# Altium schematic sheet RelayModule_LED.SchDoc
size 420 x 297 mm; DocumentNumber: VSL.23-RELAYMODULE Э3; SheetNumber: 4; Format: A3
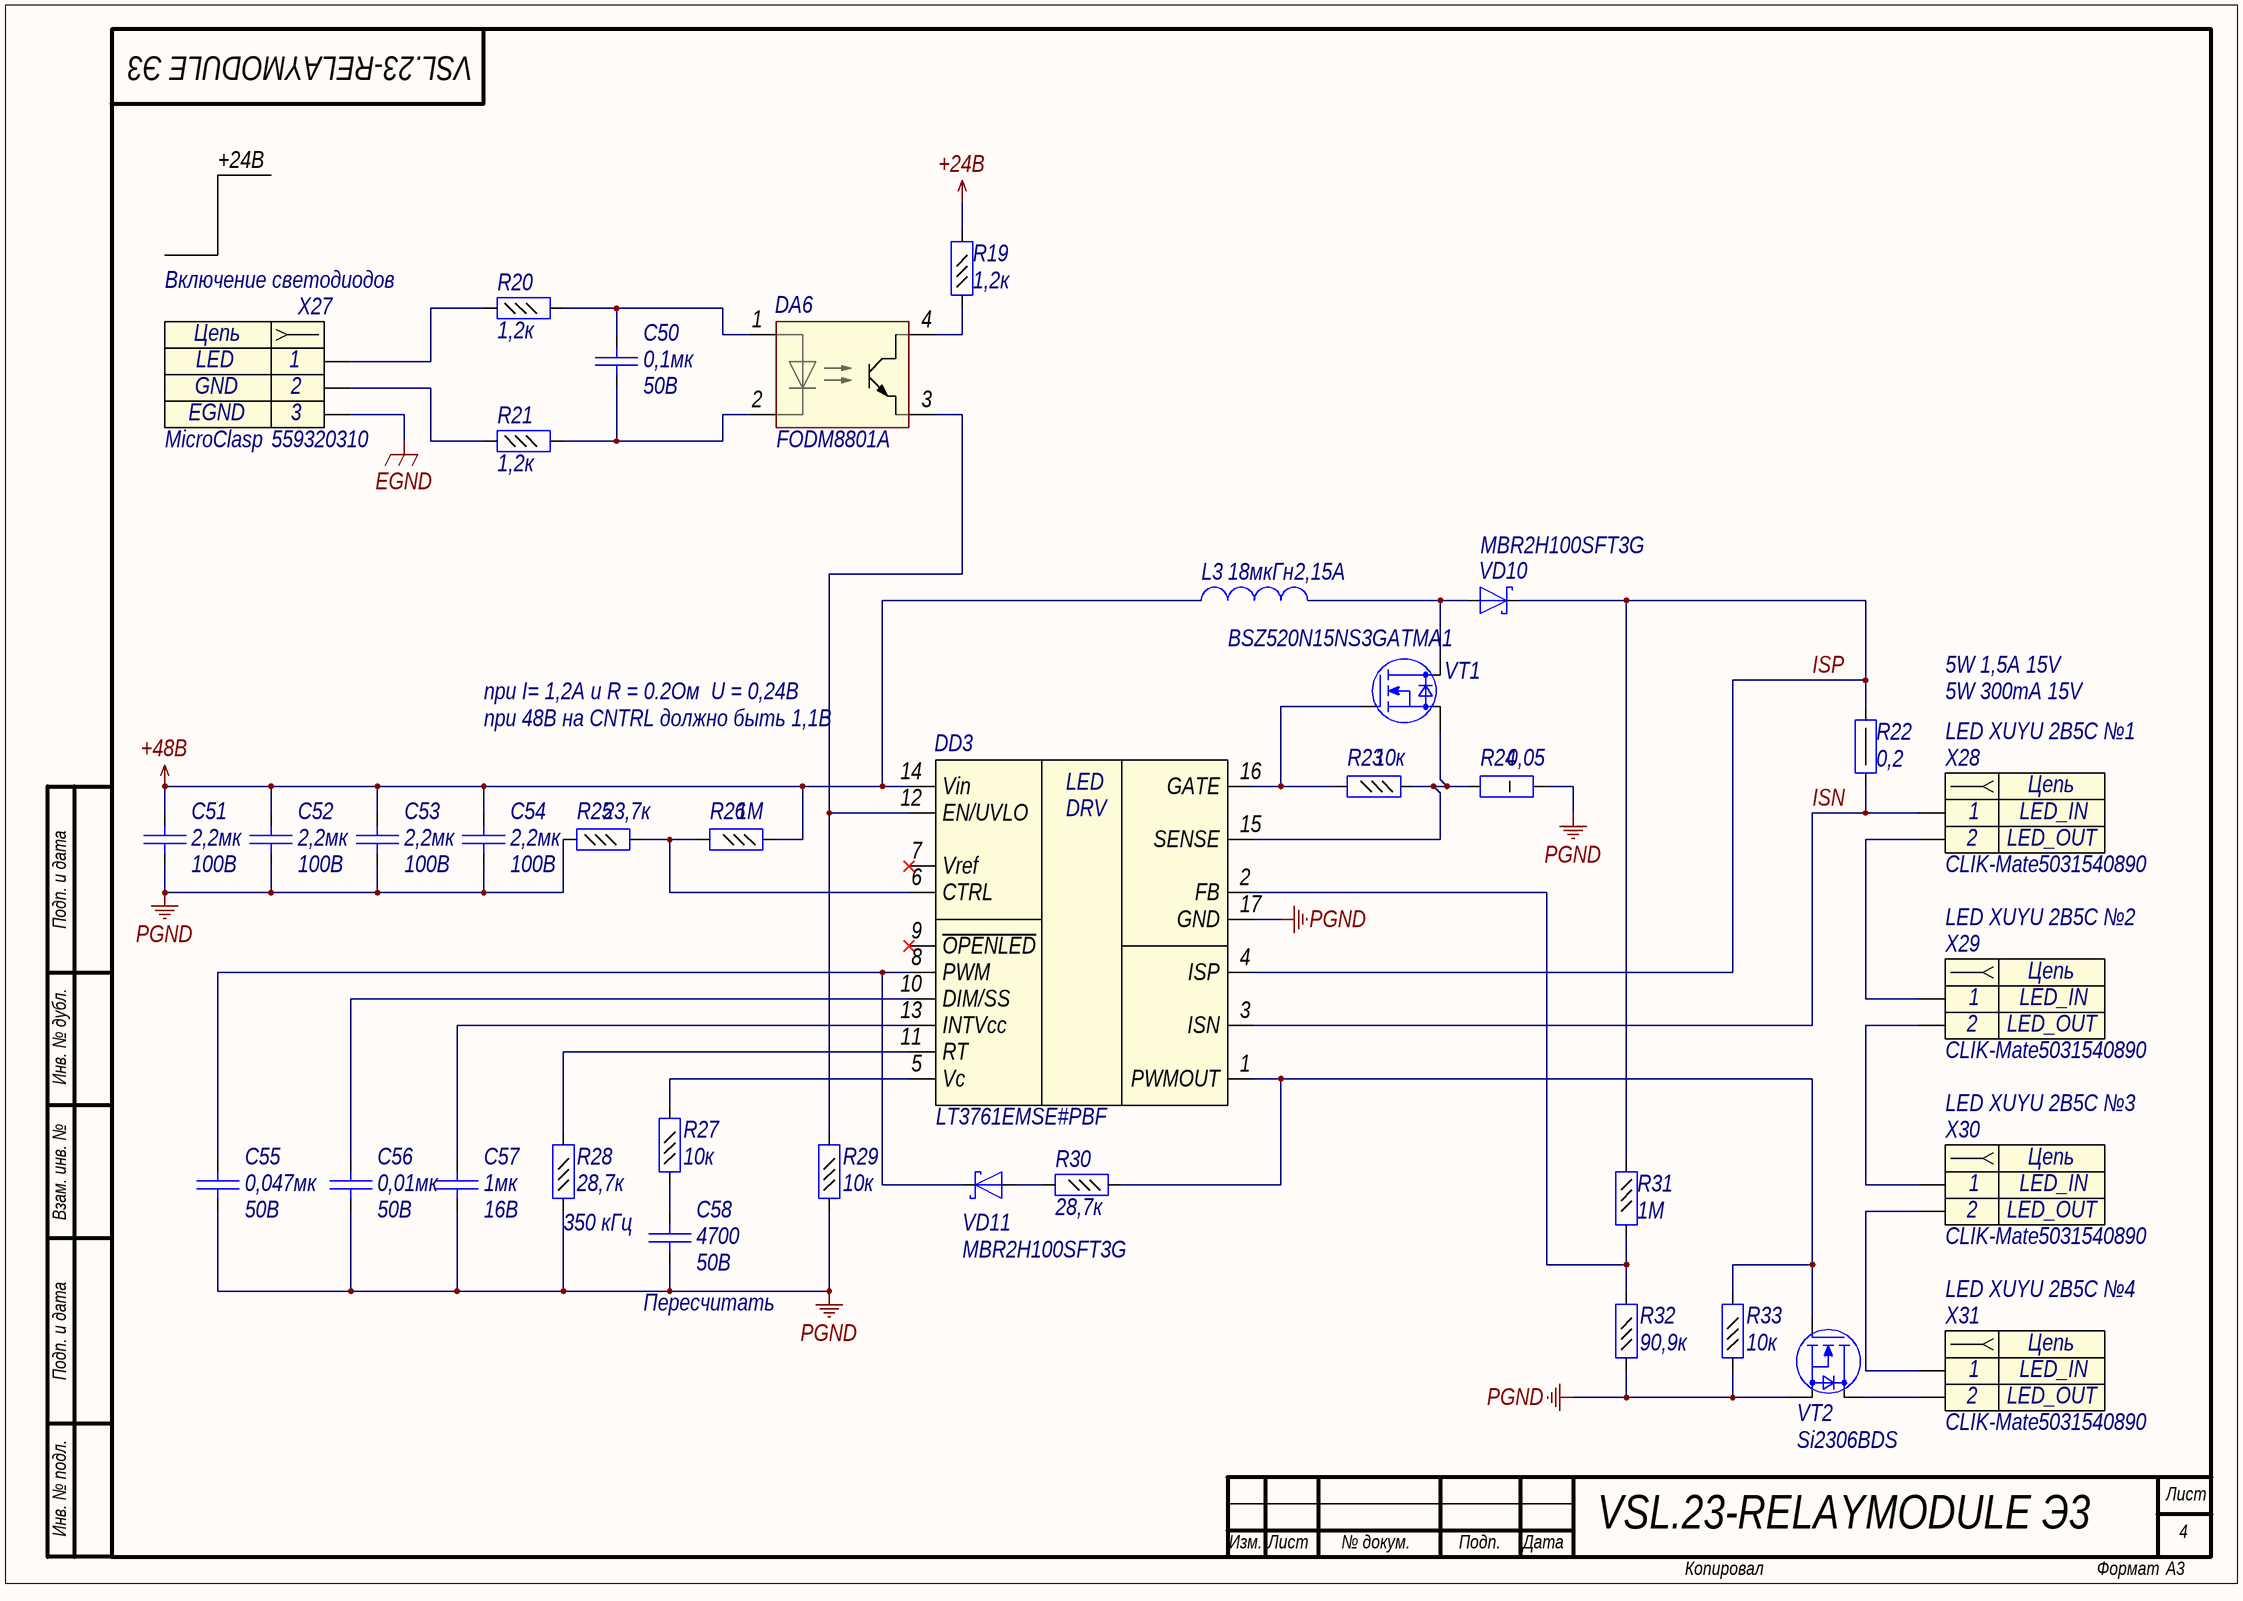
[diagram p0: RelayModule_LED.SchDoc]

## Parts
C50  Voltage: 50В  [C0402]  (hidden comment: 0,1мк)
C51  Voltage: 100В  [C1812]  (hidden comment: 2,2мк)
C52  Voltage: 100В  [C1812]  (hidden comment: 2,2мк)
C53  Voltage: 100В  [C1812]  (hidden comment: 2,2мк)
C54  Voltage: 100В  [C1812]  (hidden comment: 2,2мк)
C55  Voltage: 50В  [C0402]  (hidden comment: 0,047мк)
C56  Voltage: 50B  [C0402]  (hidden comment: 0,01мк)
C57  value 1мк  Voltage: 16B  [C0603]  (hidden comment: Capacitor)
C58  Voltage: 50B  [C0402]  (hidden comment: 4700)
DA6  Part Number: FODM8801A  [Miniflat4]  (hidden comment: OPTO-1)
DD3  Part Number: LT3761EMSE#PBF  [MSOP16]  (hidden comment: LT3761)
L3  value 18мкГн  Rated Current: 2,15A  [SDR1006]  (hidden comment: Inductor)
R19  value 1,2к  [R0402]  (hidden comment: Resistor_0,062Вт)
R20  value 1,2к  [R0402]  (hidden comment: Resistor_0,062Вт)
R21  value 1,2к  [R0402]  (hidden comment: Resistor_0,062Вт)
R22  value 0,2  [R1210]  (hidden comment: Resistor_0,5Вт)
R23  value 10к  [R0402]  (hidden comment: Resistor_0,062Вт)
R24  value 0,05  [R2010]  (hidden comment: Resistor_1Вт)
R25  value 23,7к  [R0402]  (hidden comment: Resistor_0,062Вт)
R26  value 1М  [R0402]  (hidden comment: Resistor_0,062Вт)
R27  value 10к  [R0402]  (hidden comment: Resistor_0,062Вт)
R28  value 28,7к  [R0402]  (hidden comment: Resistor_0,062Вт)
R29  value 10к  [R0402]  (hidden comment: Resistor_0,062Вт)
R30  value 28,7к  [R0402]  (hidden comment: Resistor_0,062Вт)
R31  value 1М  [R0402]  (hidden comment: Resistor_0,062Вт)
R32  value 90,9к  [R0402]  (hidden comment: Resistor_0,062Вт)
R33  value 10к  [R0402]  (hidden comment: Resistor_0,062Вт)
VD10  Part Number: MBR2H100SFT3G  [SOD-123]  (hidden comment: DiodeSchottky)
VD11  Part Number: MBR2H100SFT3G  [SOD-123]  (hidden comment: DiodeSchottky)
VT1  Part Number: BSZ520N15NS3GATMA1  [TSDSON8]  (hidden comment: N-MOSFET)
VT2  Part Number: Si2306BDS  [SOT23-3]  (hidden comment: N-MOSFET)
X27  Включение светодиодов  Part Name: MicroClasp  Part Number: 559320310  [MOLEX_559320310]
X28  LED XUYU 2B5C №1  Part Name: CLIK-Mate  Part Number: 5031540890  [MOLEX_5031540890]
X29  LED XUYU 2B5C №2  Part Name: CLIK-Mate  Part Number: 5031540890  [MOLEX_5031540890]
X30  LED XUYU 2B5C №3  Part Name: CLIK-Mate  Part Number: 5031540890  [MOLEX_5031540890]
X31  LED XUYU 2B5C №4  Part Name: CLIK-Mate  Part Number: 5031540890  [MOLEX_5031540890]

## Nets
+24B: R19.2
+48B: C51.2 C52.2 C53.2 C54.2 DD3.14(Vin) L3.1 R26.1
EGND: X27.3
PGND: C51.1 C52.1 C53.1 C54.1 C55.1 C56.1 C57.1 C58.1 DD3.17(GND) R24.2 R25.1 R28.1 R29.1 R32.1 R33.1 VT2.3(S)
ISN: DD3.3(ISN) R22.2 X28.1
ISP: DD3.4(ISP) R22.1 R31.1 VD10.1(K)
NetC50_1: C50.1 DA6.2 R21.2
NetC50_2: C50.2 DA6.1 R20.2
NetC55_2: C55.2 DD3.8(PWM) VD11.1(K)
NetC56_2: C56.2 DD3.10(DIM/SS)
NetC57_2: C57.2 DD3.13(INTVcc)
NetC58_2: C58.2 R27.1
NetDA6_3: DA6.3 DD3.12(EN/UVLO) R29.2
NetDA6_4: DA6.4 R19.1
NetDD3_1: DD3.1(PWMOUT) R30.1 R33.2 VT2.1(G)
NetDD3_2: DD3.2(FB) R31.2 R32.2
NetDD3_5: DD3.5(Vc) R27.2
NetDD3_6: DD3.6(CTRL) R25.2 R26.2
NetDD3_11: DD3.11(RT) R28.2
NetDD3_15: DD3.15(SENSE) R23.1 R24.1 VT1.3(S)
NetDD3_16: DD3.16(GATE) R23.2 VT1.1(G)
NetL3_2: L3.2 VD10.2(A) VT1.2(D)
NetR20_1: R20.1 X27.1
NetR21_1: R21.1 X27.2
NetR30_2: R30.2 VD11.2(A)
NetVT2_2: VT2.2(D) X31.2
NetX28_2: X28.2 X29.1
NetX29_2: X29.2 X30.1
NetX30_2: X30.2 X31.1

Not connected (* = marked no-connect by the designer): DD3 7(Vref)* 9(~{OPENLED})*

## Notes on the sheet
- +24B
- при 48B на CNTRL должно быть 1,1В
- при I= 1,2А и R = 0.2Ом  U = 0,24B
- 5W 300mA 15V
- 5W 1,5A 15V
- Подп. и дата
- Инв. № дубл.
- Взам. инв. №
- 350 кГц
- (near C58) Пересчитать
- Инв. № подл.
- Лист
- Изм.
- № докум.
- Подп.
- Дата
- Копировал
- Формат
- (in symbol connect96) Цепь
- (in symbol connect112) Цепь
- (in symbol driver28) LED; DRV

## Library data of the parts
C50 = cap277: Конденсатор; Part Name: Ceramic; Manufacture: Murata; Part Number: GRM155R71H104KE14D; id: cap277; TKE: X7R; tga: 0,10%; Value: 0,1мк
C51-C54 = cap293: Конденсатор; Part Name: MLCC; Manufacture: TDK; Part Number: C4532X7R2A225M; id: cap293; TKE: X7R; tga: 0,10%; Value: 2,2мк
C55 = cap298: Конденсатор; Part Name: Ceramic; Manufacture: Yageo; Part Number: CC0402KRX7R9BB473; id: cap298; TKE: X7R; tga: 0,10%; Value: 0,047мк
C56 = cap42: Конденсатор; Part Name: Ceramic; Manufacture: Murata; Part Number: GRM155R71H103K; id: cap42; TKE: X7R; Value: 0,01мк
C57 = cap133: Конденсатор; Part Name: Ceramic; Manufacture: Murata; Part Number: GRM188R71C105KA12D**; id: cap133; TKE: X7R
C58 = cap37: Конденсатор; Part Name: Ceramic; Manufacture: Murata; Part Number: GRM155R71H472K; id: cap37; TKE: X7R; Value: 4700
DA6 = FODM8801A: Опторазвязка; Manufacturer: ON Semiconductor; id: opto2; Forward current: 20мА; Forward Voltage: 1,8B; Reverse voltage: 6B; Continuous collector current: 30mA; Voltage coll-emmiter: 75B; Max tempreture: +125; Min tempreture: -40; Power dissipation: 300mW
DD3 = driver28: LED Controller with  Internal PWM Generato; Part Name: 60VIN LED Controller with Internal PWM Generator; Manufacture: Analog Devices; Min Operating Supply Voltage: 4,5B; Max Operating Supply Voltage: 60B; Maximum output current: 10A; id: driver28
L3 = ind102: EMI Suppression Filter; Part Name: SMD Power Inductors; Part Number: SDR1006- 180ML; Manufacture: Bourns; id: ind102; Saturation Current: 3,8A; Resistance: 0,090Ohm
R19-R21 = res272: Резистор; Manufacture: Yageo; Part Number: RC0402FR-071K2; id: res272; Accuracy: 0,01; Part Name: Resistor; Power: 0,062Вт
R22 = RL1210FR-070R2L: Резистор; Part Name: Current Sense Resistors; Manufacture: Yageo; id: shunt3; Accuracy: 0,01; Power: 0,5Вт; Part Number: RL1210FR-070R2L
R23 R27 R29 R33 = res294: Резистор; Manufacture: Yageo; Part Number: RC0402FR-0710KL; id: res294; Accuracy: 0,01; Part Name: Resistor; Power: 0,062Вт
R24 = RL2010FK-070R05L: Резистор; Part Name: Current Sense Resistors; Manufacture: Yageo; id: shunt6; Accuracy: 0,01; Power: 0,75Вт; Part Number: RL2010FK-070R05L
R25 = res1171: Резистор; Manufacture: Yageo; Part Number: RC0402FR-0723K7L; Accuracy: 0,01; id: res1171; Part Name: Resistor; Power: 0,062Вт
R26 R31 = res342: Резистор; Manufacture: Yageo; Part Number: RC0402FR-071ML; id: res342; Accuracy: 0,01; Part Name: Resistor; Power: 0,062Вт
R28 R30 = res1196: Резистор; Manufacture: Yageo; Part Number: RC0402FR-0728K7L; Accuracy: 0,01; id: res1196; Part Name: Resistor; Power: 0,062Вт
R32 = res1205: Резистор; Manufacture: Yageo; Part Number: RC0402FR-0790K9L; Accuracy: 0,01; id: res1205; Part Name: Resistor; Power: 0,062Вт
VD10 VD11 = diode27: Диод Шоттки; Manufacture: ON Semiconductor; Max Reverse Voltage: 100B; Forward Current: 2А; Breakdown Current: 0,5mA; Number of Channels: 1; id: diode27; Part Name: Diode Schottky; Breakdown Voltage: 100B
VT1 = mosfert23: Manufacturer: Infineon Technologies; Structure: n-channel; V drain-source max: 150B; Rds: 0,052Ohm; Gate-to-source voltage: (+-)20B; Continuous drain current: 21A; Total gate charge: 12nC; Pulsed drain current: 84A; Power dissipation: 57W; id: mosfert23
VT2 = mosfert25: Manufacturer: Vishay; Structure: n-channel; V drain-source max: 30B; Rds: 0,047Ohm; Gate-to-source voltage: (+-)20B; Continuous drain current: 4A; Total gate charge: 9nC; Pulsed drain current: 20A; Power dissipation: 0,75W; id: mosfert25
X27 = connect96: Разъем - 3 конт. розетка; Manufacture: Molex; Contact_1: LED; Contact_2: GND; Contact_3: EGND; Etch: 2mm; id: connect96
X28-X31 = connect112: Разъем - 2 конт. розетка; Manufacture: Molex; Contact_1: LED_IN; Contact_2: LED_OUT; Etch: 1.25mm; id: connect112